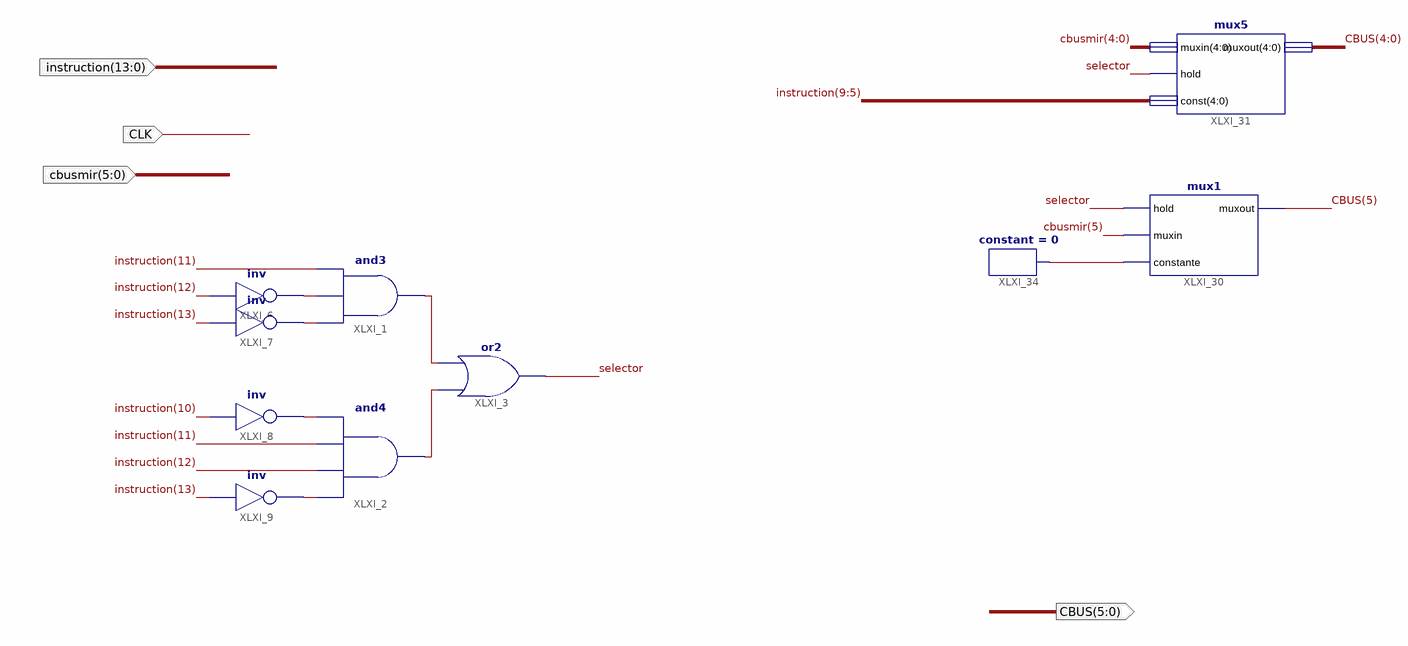
[diagram p0: schematic sheet 1]
// Xilinx ISE schematic Decode.sch (artix7) as structural Verilog: 10 symbols, 4 ports
module Decode (
  input  CLK,
  input  [5:0] cbusmir,
  input  [13:0] instruction,
  output [5:0] CBUS
);

  wire selector, XLXN_4, XLXN_5, XLXN_6, XLXN_7, XLXN_8, XLXN_9, XLXN_147;

  and XLXI_1 (XLXN_4, XLXN_7, XLXN_6, instruction[11]);
  and XLXI_2 (XLXN_5, XLXN_9, instruction[12], instruction[11], XLXN_8);
  not XLXI_6 (XLXN_6, instruction[12]);
  not XLXI_7 (XLXN_7, instruction[13]);
  not XLXI_8 (XLXN_8, instruction[10]);
  not XLXI_9 (XLXN_9, instruction[13]);
  or XLXI_3 (selector, XLXN_5, XLXN_4);
  mux5 XLXI_31 (.muxin(cbusmir[4:0]), .hold(selector), .\const (instruction[9:5]), .muxout(CBUS[4:0]));
  mux1 XLXI_30 (.hold(selector), .muxin(cbusmir[5]), .constante(XLXN_147), .muxout(CBUS[5]));
  constant #(.CValue("0")) XLXI_34 (.O(XLXN_147));
endmodule
